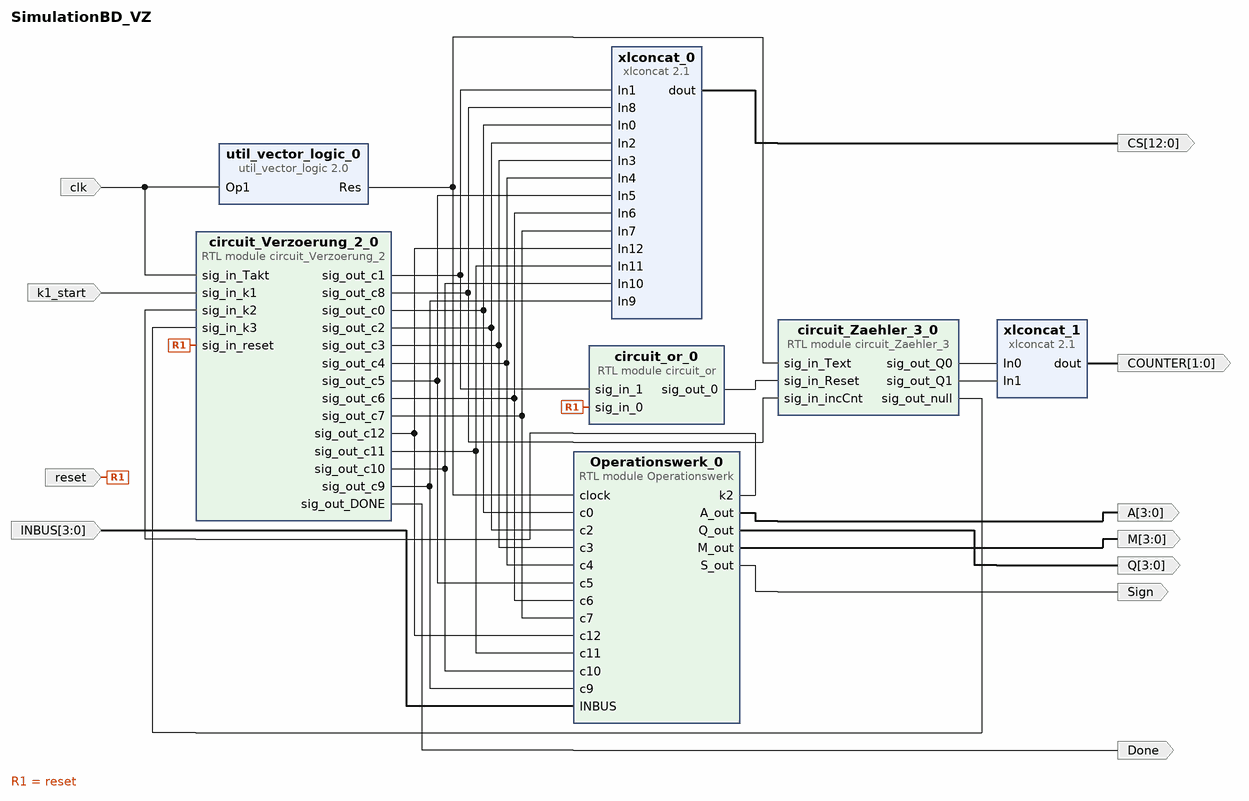
[diagram p0: block diagram of the top level]
# Vivado block design SimulationBD_VZ, xcvc1802-viva1596-1LHP-i-L, Vivado 2020.3
create_bd_design SimulationBD_VZ

create_bd_port -dir I reset
create_bd_port -dir I k1_start
create_bd_port -dir I -from 3 -to 0 INBUS
create_bd_port -dir O -from 3 -to 0 A
create_bd_port -dir O -from 3 -to 0 Q
create_bd_port -dir O -from 3 -to 0 M
create_bd_port -dir O Sign
create_bd_port -dir O Done
create_bd_port -dir O -from 1 -to 0 COUNTER
create_bd_port -dir I clk
create_bd_port -dir O -from 12 -to 0 CS

create_bd_cell -type module -reference circuit_Verzoerung_2 circuit_Verzoerung_2_0
create_bd_cell -type module -reference circuit_Zaehler_3 circuit_Zaehler_3_0
create_bd_cell -type module -reference circuit_or circuit_or_0
create_bd_cell -type module -reference Operationswerk Operationswerk_0
create_bd_cell -type ip -vlnv xilinx.com:ip:util_vector_logic:2.0 util_vector_logic_0
set_property -dict {CONFIG.C_OPERATION not CONFIG.C_SIZE 1} [get_bd_cells util_vector_logic_0]
create_bd_cell -type ip -vlnv xilinx.com:ip:xlconcat:2.1 xlconcat_0
set_property -dict {CONFIG.NUM_PORTS 13 CONFIG.dout_width 13} [get_bd_cells xlconcat_0]
create_bd_cell -type ip -vlnv xilinx.com:ip:xlconcat:2.1 xlconcat_1
set_property -dict {CONFIG.NUM_PORTS 2 CONFIG.dout_width 2} [get_bd_cells xlconcat_1]

# ---- connections ----

connect_bd_net -net Steuerwerk_Moore_0_c0 [get_bd_pins circuit_Verzoerung_2_0/sig_out_c0] \
  [get_bd_pins Operationswerk_0/c0] [get_bd_pins xlconcat_0/In0]
connect_bd_net -net Steuerwerk_Moore_0_c2 [get_bd_pins circuit_Verzoerung_2_0/sig_out_c2] \
  [get_bd_pins Operationswerk_0/c2] [get_bd_pins xlconcat_0/In2]
connect_bd_net -net Steuerwerk_Moore_0_c3 [get_bd_pins circuit_Verzoerung_2_0/sig_out_c3] \
  [get_bd_pins Operationswerk_0/c3] [get_bd_pins xlconcat_0/In3]
connect_bd_net -net Steuerwerk_Moore_0_c4 [get_bd_pins circuit_Verzoerung_2_0/sig_out_c4] \
  [get_bd_pins Operationswerk_0/c4] [get_bd_pins xlconcat_0/In4]
connect_bd_net -net Steuerwerk_Moore_0_c5 [get_bd_pins circuit_Verzoerung_2_0/sig_out_c5] \
  [get_bd_pins Operationswerk_0/c5] [get_bd_pins xlconcat_0/In5]
connect_bd_net -net Steuerwerk_Moore_0_c6 [get_bd_pins circuit_Verzoerung_2_0/sig_out_c6] \
  [get_bd_pins Operationswerk_0/c6] [get_bd_pins xlconcat_0/In6]
connect_bd_net -net Steuerwerk_Moore_0_c7 [get_bd_pins circuit_Verzoerung_2_0/sig_out_c7] \
  [get_bd_pins Operationswerk_0/c7] [get_bd_pins xlconcat_0/In7]
connect_bd_net -net Steuerwerk_Moore_0_c12 [get_bd_pins circuit_Verzoerung_2_0/sig_out_c12] \
  [get_bd_pins Operationswerk_0/c12] [get_bd_pins xlconcat_0/In12]
connect_bd_net -net Steuerwerk_Moore_0_c11 [get_bd_pins circuit_Verzoerung_2_0/sig_out_c11] \
  [get_bd_pins Operationswerk_0/c11] [get_bd_pins xlconcat_0/In11]
connect_bd_net -net Steuerwerk_Moore_0_c10 [get_bd_pins circuit_Verzoerung_2_0/sig_out_c10] \
  [get_bd_pins Operationswerk_0/c10] [get_bd_pins xlconcat_0/In10]
connect_bd_net -net Steuerwerk_Moore_0_c9 [get_bd_pins circuit_Verzoerung_2_0/sig_out_c9] \
  [get_bd_pins Operationswerk_0/c9] [get_bd_pins xlconcat_0/In9]
connect_bd_net [get_bd_ports INBUS] [get_bd_pins Operationswerk_0/INBUS]
connect_bd_net [get_bd_pins Operationswerk_0/A_out] [get_bd_ports A]
connect_bd_net [get_bd_pins Operationswerk_0/Q_out] [get_bd_ports Q]
connect_bd_net [get_bd_pins Operationswerk_0/M_out] [get_bd_ports M]
connect_bd_net [get_bd_pins Operationswerk_0/S_out] [get_bd_ports Sign]
connect_bd_net [get_bd_pins xlconcat_0/dout] [get_bd_ports CS]
connect_bd_net [get_bd_pins xlconcat_1/dout] [get_bd_ports COUNTER]
connect_bd_net [get_bd_ports reset] [get_bd_pins circuit_Verzoerung_2_0/sig_in_reset] [get_bd_pins circuit_or_0/sig_in_0]
connect_bd_net [get_bd_ports k1_start] [get_bd_pins circuit_Verzoerung_2_0/sig_in_k1]
connect_bd_net [get_bd_pins Operationswerk_0/k2] [get_bd_pins circuit_Verzoerung_2_0/sig_in_k2]
connect_bd_net [get_bd_pins circuit_Zaehler_3_0/sig_out_null] [get_bd_pins circuit_Verzoerung_2_0/sig_in_k3]
connect_bd_net [get_bd_pins circuit_Verzoerung_2_0/sig_out_c8] [get_bd_pins circuit_Zaehler_3_0/sig_in_incCnt] [get_bd_pins xlconcat_0/In8]
connect_bd_net [get_bd_pins circuit_Zaehler_3_0/sig_out_Q0] [get_bd_pins xlconcat_1/In0]
connect_bd_net [get_bd_pins circuit_Zaehler_3_0/sig_out_Q1] [get_bd_pins xlconcat_1/In1]
connect_bd_net [get_bd_pins util_vector_logic_0/Res] [get_bd_pins circuit_Zaehler_3_0/sig_in_Text] [get_bd_pins Operationswerk_0/clock]
connect_bd_net [get_bd_pins circuit_or_0/sig_out_0] [get_bd_pins circuit_Zaehler_3_0/sig_in_Reset]
connect_bd_net [get_bd_pins circuit_Verzoerung_2_0/sig_out_c1] [get_bd_pins circuit_or_0/sig_in_1] [get_bd_pins xlconcat_0/In1]
connect_bd_net [get_bd_ports clk] [get_bd_pins circuit_Verzoerung_2_0/sig_in_Takt] [get_bd_pins util_vector_logic_0/Op1]
connect_bd_net [get_bd_pins circuit_Verzoerung_2_0/sig_out_DONE] [get_bd_ports Done]

validate_bd_design
save_bd_design
